# Altium schematic sheet Audio_in.SchDoc
size A4
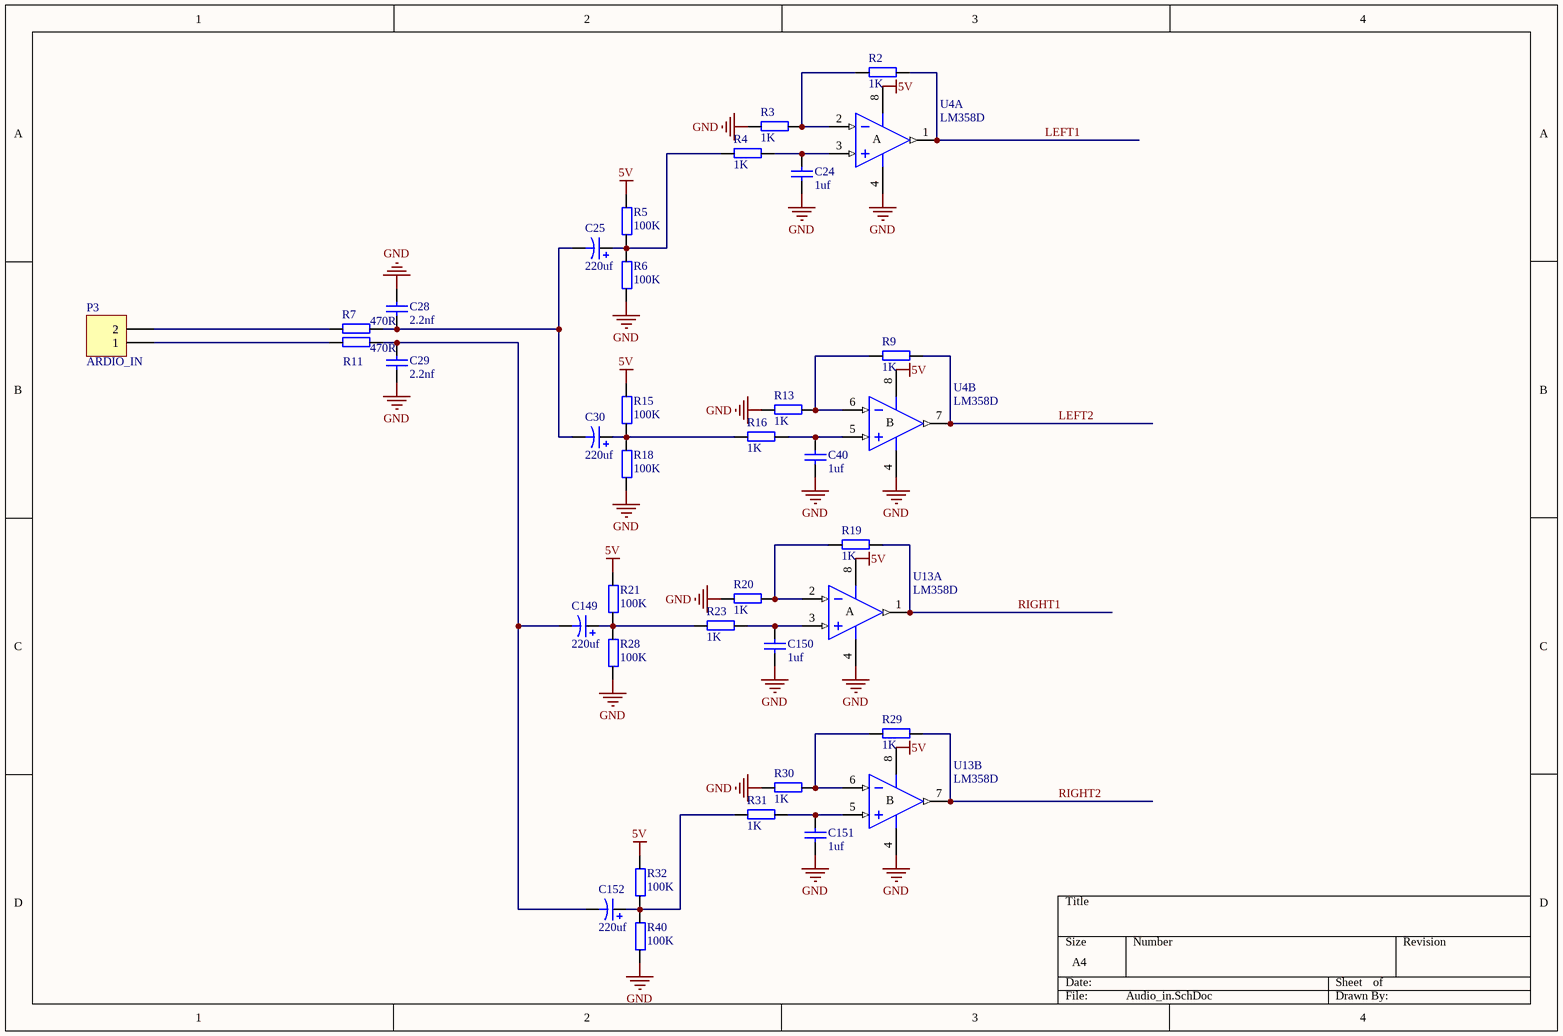
[diagram p0: Audio_in.SchDoc]

## Parts
C24  1uf  [0805C]
C25  220uf  [6032c]
C28  2.2nf  [0805C]
C29  2.2nf  [0805C]
C30  220uf  [6032c]
C40  1uf  [0805C]
C149  220uf  [6032c]
C150  1uf  [0805C]
C151  1uf  [0805C]
C152  220uf  [6032c]
P3  ARDIO_IN  [耳机座]
R2  1K  [0805R]
R3  1K  [0805R]
R4  1K  [0805R]
R5  100K  [0805R]
R6  100K  [0805R]
R7  470R  [0805R]
R9  1K  [0805R]
R11  470R  [0805R]
R13  1K  [0805R]
R15  100K  [0805R]
R16  1K  [0805R]
R18  100K  [0805R]
R19  1K  [0805R]
R20  1K  [0805R]
R21  100K  [0805R]
R23  1K  [0805R]
R28  100K  [0805R]
R29  1K  [0805R]
R30  1K  [0805R]
R31  1K  [0805R]
R32  100K  [0805R]
R40  100K  [0805R]
U4  LM358D  [D008_L]  (parts A,B of 2)
U13  LM358D  [D008_L]  (parts A,B of 2)

## Nets
5V: R5.2 R15.2 R21.2 R32.2 U4.8(V+) U13.8(V+)
GND: C24.2 C28.1 C29.2 C40.2 C150.2 C151.2 R3.2 R6.1 R13.2 R18.1 R20.2 R28.1 R30.2 R40.1 U4.4(V-) U13.4(V-)
LEFT1: R2.1 U4.1(OUT)
LEFT2: R9.1 U4.7(OUT)
RIGHT1: R19.1 U13.1(OUT)
RIGHT2: R29.1 U13.7(OUT)
NetC24_1: C24.1 R4.1 U4.3(IN+)
NetC25_1: C25.1 R4.2 R5.1 R6.2
NetC25_2: C25.2 C28.2 C30.2 R7.1
NetC29_1: C29.1 C149.2 C152.2 R11.1
NetC30_1: C30.1 R15.1 R16.2 R18.2
NetC40_1: C40.1 R16.1 U4.5(IN+)
NetC149_1: C149.1 R21.1 R23.2 R28.2
NetC150_1: C150.1 R23.1 U13.3(IN+)
NetC151_1: C151.1 R31.1 U13.5(IN+)
NetC152_1: C152.1 R31.2 R32.1 R40.2
NetP3_1: P3.1 R11.2
NetP3_2: P3.2 R7.2
NetR2_2: R2.2 R3.1 U4.2(IN-)
NetR9_2: R9.2 R13.1 U4.6(IN-)
NetR19_2: R19.2 R20.1 U13.2(IN-)
NetR29_2: R29.2 R30.1 U13.6(IN-)

## Notes on the sheet
- (in symbol LM358D, part A) A
- (in symbol LM358D, part B) B

## Library data of the parts
C24 C28 C29 C40 C150 C151 = Cap: Capacitor; Value: 0.1uF; Published: 8-Jun-2000; LatestRevisionDate: 17-Jul-2002; LatestRevisionNote: Re-released for DXP Platform.; PackageReference: RAD-0.3; Publisher: Altium Limited; PackageDescription: Radial Cap, Thru-Hole; 2 Leads; 0.3 in Pin Spacing
C25 C30 C149 C152 = Cap Pol1: Polarized Capacitor (Radial); Published: 8-Jun-2000; LatestRevisionDate: 17-Jul-2002; LatestRevisionNote: Re-released for DXP Platform.; PackageReference: RB7.6-15; Publisher: Altium Limited; PackageDescription: Polarized Capacitor (Radial); 2 Leads
P3 = Header 2: Header, 2-Pin; LatestRevisionDate: 17-Jul-2002; LatestRevisionNote: Re-released for DXP Platform.; Publisher: Altium Limited
R2-R7 R9 R11 R13 R15 R16 R18-R21 R23 R28-R32 R40 = R
U4 U13 = LM358D: Dual Operational Amplifier; Published: 16-Jan-2001; LatestRevisionDate: 13-Apr-2006; LatestRevisionNote: IPC-7351 Footprint Added.; DatasheetVersion: Jul-1998; PackageVersion: Jan-1998; PackageReference: D008; Publisher: Altium Limited; PackageDescription: 8-Pin Small Outline Integrated Circuit 1.27 mm Pitch; Code_IPC: SOIC127P600-8; ComponentLink1Description: Manufacturer Link; ComponentLink1URL: http://www.ti.com/; ComponentLink2Description: Datasheet; ComponentLink2URL: http://www-s.ti.com/sc/ds/lm358.pdf